# Altium project Infrared reception.PrjPcb
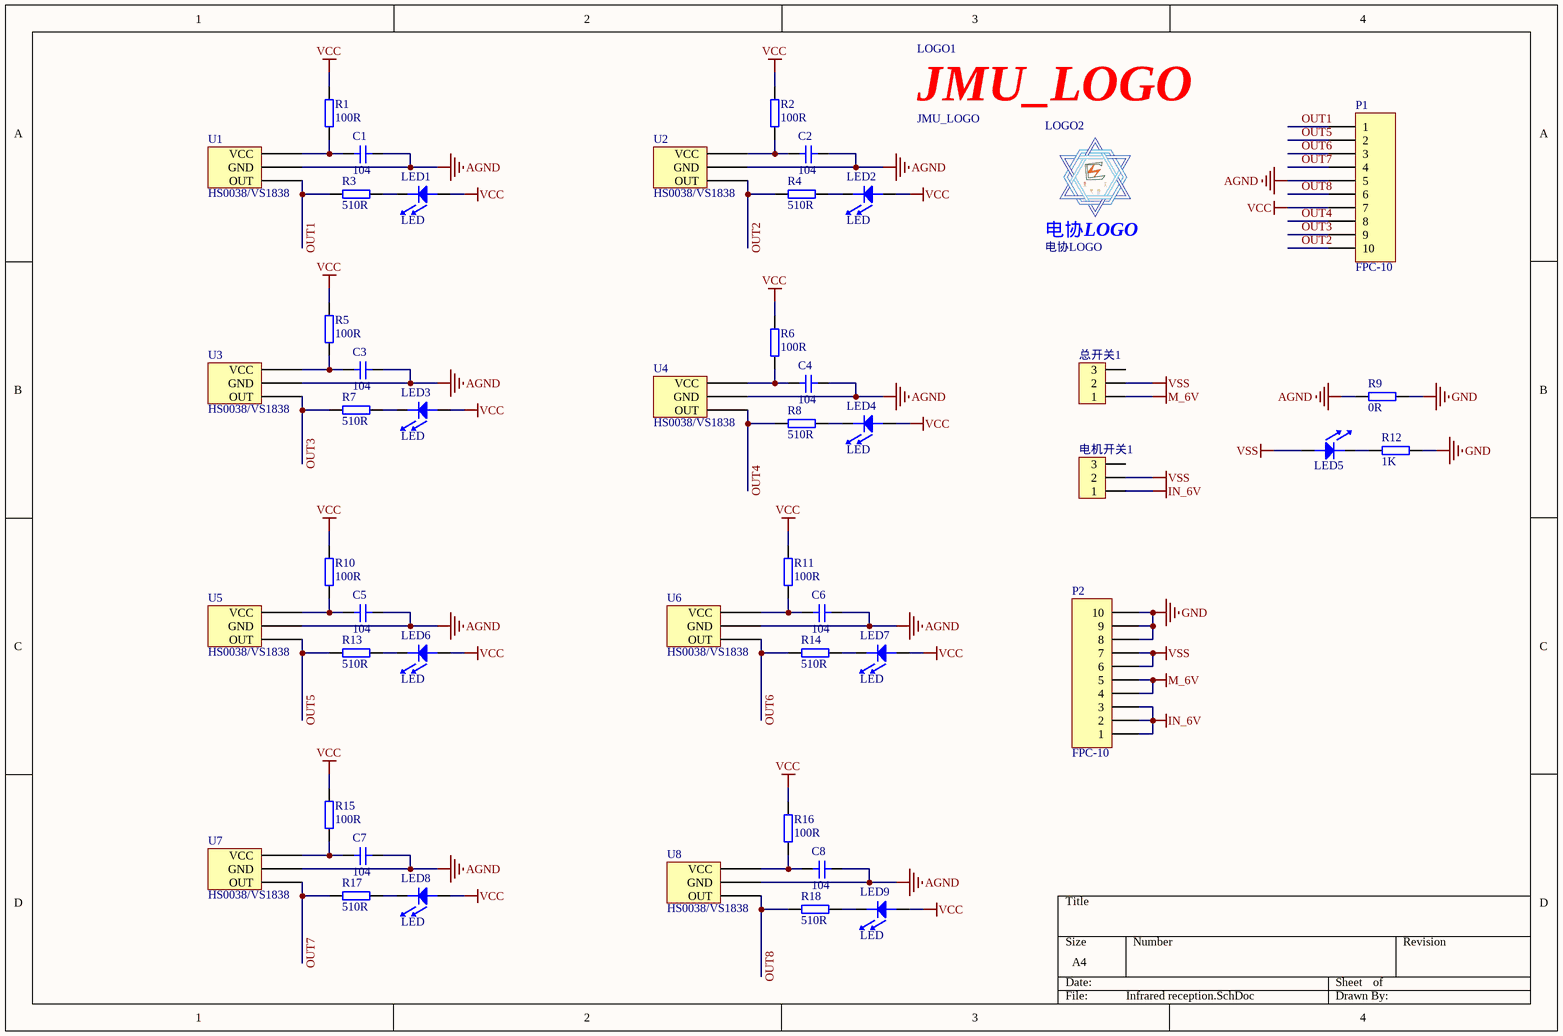
[diagram p0: Infrared reception.SchDoc]
1 sheet, 49 parts. Net scope: global (net labels, ports and power ports of the same name join across sheets).
Board files: Infrared reception V2.0.PcbDoc, Infrared reception.PcbDoc

## Sheet Infrared reception.SchDoc
size A4

### Parts
C1  104  [0805C]
C2  104  [0805C]
C3  104  [0805C]
C4  104  [0805C]
C5  104  [0805C]
C6  104  [0805C]
C7  104  [0805C]
C8  104  [0805C]
LED1  LED  [0805LED]
LED2  LED  [0805LED]
LED3  LED  [0805LED]
LED4  LED  [0805LED]
LED5  LED2  [LED(0805)]  (value not drawn)
LED6  LED  [0805LED]
LED7  LED  [0805LED]
LED8  LED  [0805LED]
LED9  LED  [0805LED]
LOGO1  JMU_LOGO  [JMU_logo（1）]
LOGO2  电协LOGO  [电协LOGO]
P1  FPC-10  [FPC-10]
P2  FPC-10  [FPC-10]
R1  100R  [0805R]
R2  100R  [0805R]
R3  510R  [0805R]
R4  510R  [0805R]
R5  100R  [0805R]
R6  100R  [0805R]
R7  510R  [0805R]
R8  510R  [0805R]
R9  0R  [0805R]
R10  100R  [0805R]
R11  100R  [0805R]
R12  1K  [0805R]
R13  510R  [0805R]
R14  510R  [0805R]
R15  100R  [0805R]
R16  100R  [0805R]
R17  510R  [0805R]
R18  510R  [0805R]
U1  HS0038/VS1838  [HS0038]
U2  HS0038/VS1838  [HS0038]
U3  HS0038/VS1838  [HS0038]
U4  HS0038/VS1838  [HS0038]
U5  HS0038/VS1838  [HS0038]
U6  HS0038/VS1838  [HS0038]
U7  HS0038/VS1838  [HS0038]
U8  HS0038/VS1838  [HS0038]
总开关1  Header 3  [钮子开关(小)]  (value not drawn)
电机开关1  Header 3  [钮子开关(小)]  (value not drawn)

### Nets
AGND: C1.2 C2.2 C3.2 C4.2 C5.2 C6.2 C7.2 C8.2 P1.5 R9.1 U1.2(GND) U2.2(GND) U3.2(GND) U4.2(GND) U5.2(GND) U6.2(GND) U7.2(GND) U8.2(GND)
GND: P2.8 P2.9 P2.10 R9.2 R12.1
IN_6V: P2.1 P2.2 P2.3 电机开关1.1
M_6V: P2.4 P2.5 总开关1.1
VCC: LED1.1 LED2.1 LED3.1 LED4.1 LED6.1 LED7.1 LED8.1 LED9.1 P1.7 R1.2 R2.2 R5.2 R6.2 R10.2 R11.2 R15.2 R16.2
VSS: LED5.1 P2.6 P2.7 总开关1.2 电机开关1.2
OUT1: P1.1 R3.1 U1.1(OUT)
OUT2: P1.10 R4.1 U2.1(OUT)
OUT3: P1.9 R7.1 U3.1(OUT)
OUT4: P1.8 R8.1 U4.1(OUT)
OUT5: P1.2 R13.1 U5.1(OUT)
OUT6: P1.3 R14.1 U6.1(OUT)
OUT7: P1.4 R17.1 U7.1(OUT)
OUT8: P1.6 R18.1 U8.1(OUT)
NetC1_1: C1.1 R1.1 U1.3(VCC)
NetC2_1: C2.1 R2.1 U2.3(VCC)
NetC3_1: C3.1 R5.1 U3.3(VCC)
NetC4_1: C4.1 R6.1 U4.3(VCC)
NetC5_1: C5.1 R10.1 U5.3(VCC)
NetC6_1: C6.1 R11.1 U6.3(VCC)
NetC7_1: C7.1 R15.1 U7.3(VCC)
NetC8_1: C8.1 R16.1 U8.3(VCC)
NetLED1_2: LED1.2 R3.2
NetLED2_2: LED2.2 R4.2
NetLED3_2: LED3.2 R7.2
NetLED4_2: LED4.2 R8.2
NetLED5_2: LED5.2 R12.2
NetLED6_2: LED6.2 R13.2
NetLED7_2: LED7.2 R14.2
NetLED8_2: LED8.2 R17.2
NetLED9_2: LED9.2 R18.2

Not connected (* = marked no-connect by the designer): 总开关1 3; 电机开关1 3

### Library data of the parts
C1-C8 = Cap1: 无极贴片电容
LED1-LED9 = LED: 发光二极管
LOGO1 = JMU_LOGO: LOGO
P1 P2 = FPC-10: 软排线底座
R1-R18 = Res: 电阻
U1-U8 = HS0038/VS1838: 一体化红外接收头
总开关1 电机开关1 = Header 3: 排针